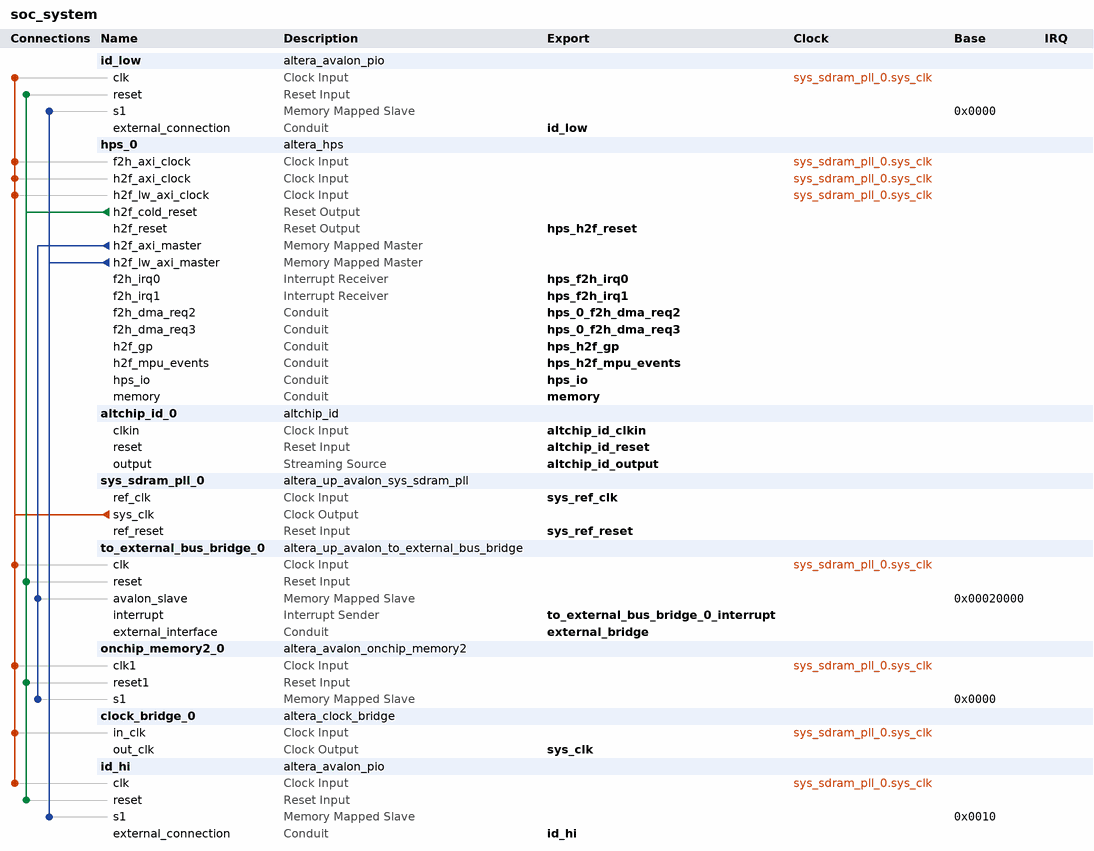
[diagram p0: system contents]
# Platform Designer (Qsys) system soc_system, Cyclone V 5CSEMA5F31C6
# Parameters at their usual value, and those the tool derives, are not listed.
package require -exact qsys 20.1
create_system soc_system
set_project_property DEVICE_FAMILY {Cyclone V}
set_project_property DEVICE 5CSEMA5F31C6

add_instance id_low altera_avalon_pio 20.1
set_instance_parameter_value id_low direction Input
set_instance_parameter_value id_low width 32

add_instance hps_0 altera_hps 20.1
set_instance_parameter_value hps_0 DMA_Enable No,No,Yes,Yes,No,No,No,No
set_instance_parameter_value hps_0 EMAC1_Mode RGMII
set_instance_parameter_value hps_0 EMAC1_PinMuxing {HPS I/O Set 0}
set_instance_parameter_value hps_0 F2SCLK_COLDRST_Enable false
set_instance_parameter_value hps_0 F2SCLK_DBGRST_Enable false
set_instance_parameter_value hps_0 F2SCLK_WARMRST_Enable false
set_instance_parameter_value hps_0 F2SINTERRUPT_Enable true
set_instance_parameter_value hps_0 F2S_Width 3
set_instance_parameter_value hps_0 FPGA_PERIPHERAL_OUTPUT_CLOCK_FREQ_EMAC0_GTX_CLK 125
set_instance_parameter_value hps_0 FPGA_PERIPHERAL_OUTPUT_CLOCK_FREQ_EMAC0_MD_CLK 2.5
set_instance_parameter_value hps_0 FPGA_PERIPHERAL_OUTPUT_CLOCK_FREQ_EMAC1_GTX_CLK 125
set_instance_parameter_value hps_0 FPGA_PERIPHERAL_OUTPUT_CLOCK_FREQ_EMAC1_MD_CLK 2.5
set_instance_parameter_value hps_0 GP_Enable true
set_instance_parameter_value hps_0 HPS_PROTOCOL DDR3
set_instance_parameter_value hps_0 I2C0_Mode I2C
set_instance_parameter_value hps_0 I2C0_PinMuxing {HPS I/O Set 0}
set_instance_parameter_value hps_0 I2C1_Mode I2C
set_instance_parameter_value hps_0 I2C1_PinMuxing {HPS I/O Set 0}
set_instance_parameter_value hps_0 LWH2F_Enable true
set_instance_parameter_value hps_0 MEM_BANKADDR_WIDTH 3
set_instance_parameter_value hps_0 MEM_CLK_FREQ 400.0
set_instance_parameter_value hps_0 MEM_COL_ADDR_WIDTH 10
set_instance_parameter_value hps_0 MEM_DQ_WIDTH 32
set_instance_parameter_value hps_0 MEM_DRV_STR RZQ/7
set_instance_parameter_value hps_0 MEM_ROW_ADDR_WIDTH 15
set_instance_parameter_value hps_0 MEM_RTT_NOM RZQ/4
set_instance_parameter_value hps_0 MEM_RTT_WR RZQ/4
set_instance_parameter_value hps_0 MEM_TCL 11
set_instance_parameter_value hps_0 MEM_TFAW_NS 30.0
set_instance_parameter_value hps_0 MEM_TRAS_NS 35.0
set_instance_parameter_value hps_0 MEM_TRCD_NS 13.75
set_instance_parameter_value hps_0 MEM_TRFC_NS 260.0
set_instance_parameter_value hps_0 MEM_TRP_NS 13.75
set_instance_parameter_value hps_0 MEM_VENDOR JEDEC
set_instance_parameter_value hps_0 MEM_WTCL 8
set_instance_parameter_value hps_0 MPU_EVENTS_Enable true
set_instance_parameter_value hps_0 QSPI_Mode {1 SS}
set_instance_parameter_value hps_0 QSPI_PinMuxing {HPS I/O Set 0}
set_instance_parameter_value hps_0 REF_CLK_FREQ 25.0
set_instance_parameter_value hps_0 S2FCLK_COLDRST_Enable true
set_instance_parameter_value hps_0 S2FCLK_USER2CLK 0
set_instance_parameter_value hps_0 S2F_Width 2
set_instance_parameter_value hps_0 SDIO_Mode {4-bit Data}
set_instance_parameter_value hps_0 SDIO_PinMuxing {HPS I/O Set 0}
set_instance_parameter_value hps_0 SPIM1_Mode {Single Slave Select}
set_instance_parameter_value hps_0 SPIM1_PinMuxing {HPS I/O Set 0}
set_instance_parameter_value hps_0 STM_Enable false
set_instance_parameter_value hps_0 TIMING_BOARD_AC_SKEW 0.03
set_instance_parameter_value hps_0 TIMING_BOARD_AC_TO_CK_SKEW 0.0
set_instance_parameter_value hps_0 TIMING_BOARD_DQ_TO_DQS_SKEW 0.0
set_instance_parameter_value hps_0 TIMING_BOARD_MAX_CK_DELAY 0.03
set_instance_parameter_value hps_0 TIMING_BOARD_MAX_DQS_DELAY 0.02
set_instance_parameter_value hps_0 TIMING_BOARD_SKEW_BETWEEN_DQS 0.08
set_instance_parameter_value hps_0 TIMING_BOARD_SKEW_CKDQS_DIMM_MAX 0.16
set_instance_parameter_value hps_0 TIMING_BOARD_SKEW_CKDQS_DIMM_MIN 0.09
set_instance_parameter_value hps_0 TIMING_BOARD_SKEW_WITHIN_DQS 0.01
set_instance_parameter_value hps_0 TIMING_TDH 65
set_instance_parameter_value hps_0 TIMING_TDQSCK 255
set_instance_parameter_value hps_0 TIMING_TDQSQ 125
set_instance_parameter_value hps_0 TIMING_TDS 30
set_instance_parameter_value hps_0 TIMING_TIH 140
set_instance_parameter_value hps_0 TIMING_TIS 180
set_instance_parameter_value hps_0 TIMING_TQSH 0.4
set_instance_parameter_value hps_0 UART0_Mode {No Flow Control}
set_instance_parameter_value hps_0 UART0_PinMuxing {HPS I/O Set 0}
set_instance_parameter_value hps_0 USB1_Mode SDR
set_instance_parameter_value hps_0 USB1_PinMuxing {HPS I/O Set 0}
set_instance_parameter_value hps_0 desired_cfg_clk_mhz 100.0
set_instance_parameter_value hps_0 desired_qspi_clk_mhz 400.0
set_instance_parameter_value hps_0 desired_spi_m_clk_mhz 100.0
set_instance_parameter_value hps_0 desired_usb_mp_clk_mhz 100.0
set_instance_parameter_value hps_0 use_default_mpu_clk false

add_instance altchip_id_0 altchip_id 20.1
set_instance_parameter_value altchip_id_0 ID_VALUE 18446744073709551615

add_instance sys_sdram_pll_0 altera_up_avalon_sys_sdram_pll 18.0
set_instance_parameter_value sys_sdram_pll_0 CV_boards DE1-SoC
set_instance_parameter_value sys_sdram_pll_0 gui_outclk 25.0
set_instance_parameter_value sys_sdram_pll_0 gui_refclk 50.0

add_instance to_external_bus_bridge_0 altera_up_avalon_to_external_bus_bridge 18.0
set_instance_parameter_value to_external_bus_bridge_0 addr_size 64
set_instance_parameter_value to_external_bus_bridge_0 addr_size_multiplier bytes
set_instance_parameter_value to_external_bus_bridge_0 data_size 64

add_instance onchip_memory2_0 altera_avalon_onchip_memory2 20.1
set_instance_parameter_value onchip_memory2_0 dataWidth 128
set_instance_parameter_value onchip_memory2_0 dualPort false
set_instance_parameter_value onchip_memory2_0 initMemContent true
set_instance_parameter_value onchip_memory2_0 initializationFileName onchip_mem.hex
set_instance_parameter_value onchip_memory2_0 memorySize 131072

add_instance clock_bridge_0 altera_clock_bridge 20.1
set_instance_parameter_value clock_bridge_0 DERIVED_CLOCK_RATE 25000000
set_instance_parameter_value clock_bridge_0 EXPLICIT_CLOCK_RATE 0

add_instance id_hi altera_avalon_pio 20.1
set_instance_parameter_value id_hi direction Input
set_instance_parameter_value id_hi width 32

# connections
add_connection sys_sdram_pll_0.sys_clk clock_bridge_0.in_clk clock
add_connection sys_sdram_pll_0.sys_clk hps_0.f2h_axi_clock clock
add_connection sys_sdram_pll_0.sys_clk hps_0.h2f_axi_clock clock
add_connection sys_sdram_pll_0.sys_clk hps_0.h2f_lw_axi_clock clock
add_connection sys_sdram_pll_0.sys_clk id_hi.clk clock
add_connection sys_sdram_pll_0.sys_clk id_low.clk clock
add_connection sys_sdram_pll_0.sys_clk onchip_memory2_0.clk1 clock
add_connection sys_sdram_pll_0.sys_clk to_external_bus_bridge_0.clk clock
add_connection hps_0.h2f_cold_reset id_hi.reset reset
add_connection hps_0.h2f_cold_reset id_low.reset reset
add_connection hps_0.h2f_cold_reset onchip_memory2_0.reset1 reset
add_connection hps_0.h2f_cold_reset to_external_bus_bridge_0.reset reset
add_connection hps_0.h2f_axi_master onchip_memory2_0.s1 avalon
set_connection_parameter_value hps_0.h2f_axi_master/onchip_memory2_0.s1 baseAddress 0x0000
add_connection hps_0.h2f_axi_master to_external_bus_bridge_0.avalon_slave avalon
set_connection_parameter_value hps_0.h2f_axi_master/to_external_bus_bridge_0.avalon_slave baseAddress 0x00020000
add_connection hps_0.h2f_lw_axi_master id_hi.s1 avalon
set_connection_parameter_value hps_0.h2f_lw_axi_master/id_hi.s1 baseAddress 0x0010
add_connection hps_0.h2f_lw_axi_master id_low.s1 avalon
set_connection_parameter_value hps_0.h2f_lw_axi_master/id_low.s1 baseAddress 0x0000

# exported interfaces
add_interface altchip_id_clkin clock sink
set_interface_property altchip_id_clkin EXPORT_OF altchip_id_0.clkin
add_interface altchip_id_output avalon_streaming source
set_interface_property altchip_id_output EXPORT_OF altchip_id_0.output
add_interface altchip_id_reset reset sink
set_interface_property altchip_id_reset EXPORT_OF altchip_id_0.reset
add_interface external_bridge conduit end
set_interface_property external_bridge EXPORT_OF to_external_bus_bridge_0.external_interface
add_interface hps_0_f2h_dma_req2 conduit end
set_interface_property hps_0_f2h_dma_req2 EXPORT_OF hps_0.f2h_dma_req2
add_interface hps_0_f2h_dma_req3 conduit end
set_interface_property hps_0_f2h_dma_req3 EXPORT_OF hps_0.f2h_dma_req3
add_interface hps_f2h_irq0 interrupt receiver
set_interface_property hps_f2h_irq0 EXPORT_OF hps_0.f2h_irq0
add_interface hps_f2h_irq1 interrupt receiver
set_interface_property hps_f2h_irq1 EXPORT_OF hps_0.f2h_irq1
add_interface hps_h2f_gp conduit end
set_interface_property hps_h2f_gp EXPORT_OF hps_0.h2f_gp
add_interface hps_h2f_mpu_events conduit end
set_interface_property hps_h2f_mpu_events EXPORT_OF hps_0.h2f_mpu_events
add_interface hps_h2f_reset reset source
set_interface_property hps_h2f_reset EXPORT_OF hps_0.h2f_reset
add_interface hps_io conduit end
set_interface_property hps_io EXPORT_OF hps_0.hps_io
add_interface id_hi conduit end
set_interface_property id_hi EXPORT_OF id_hi.external_connection
add_interface id_low conduit end
set_interface_property id_low EXPORT_OF id_low.external_connection
add_interface memory conduit end
set_interface_property memory EXPORT_OF hps_0.memory
add_interface sys_clk clock source
set_interface_property sys_clk EXPORT_OF clock_bridge_0.out_clk
add_interface sys_ref_clk clock sink
set_interface_property sys_ref_clk EXPORT_OF sys_sdram_pll_0.ref_clk
add_interface sys_ref_reset reset sink
set_interface_property sys_ref_reset EXPORT_OF sys_sdram_pll_0.ref_reset
add_interface to_external_bus_bridge_0_interrupt interrupt sender
set_interface_property to_external_bus_bridge_0_interrupt EXPORT_OF to_external_bus_bridge_0.interrupt

set_interconnect_requirement {$system} qsys_mm.clockCrossingAdapter HANDSHAKE
set_interconnect_requirement {$system} qsys_mm.enableEccProtection FALSE
set_interconnect_requirement {$system} qsys_mm.insertDefaultSlave FALSE
set_interconnect_requirement {$system} qsys_mm.maxAdditionalLatency 1

save_system soc_system.qsys
